# Altium project HELPME.PrjPCB
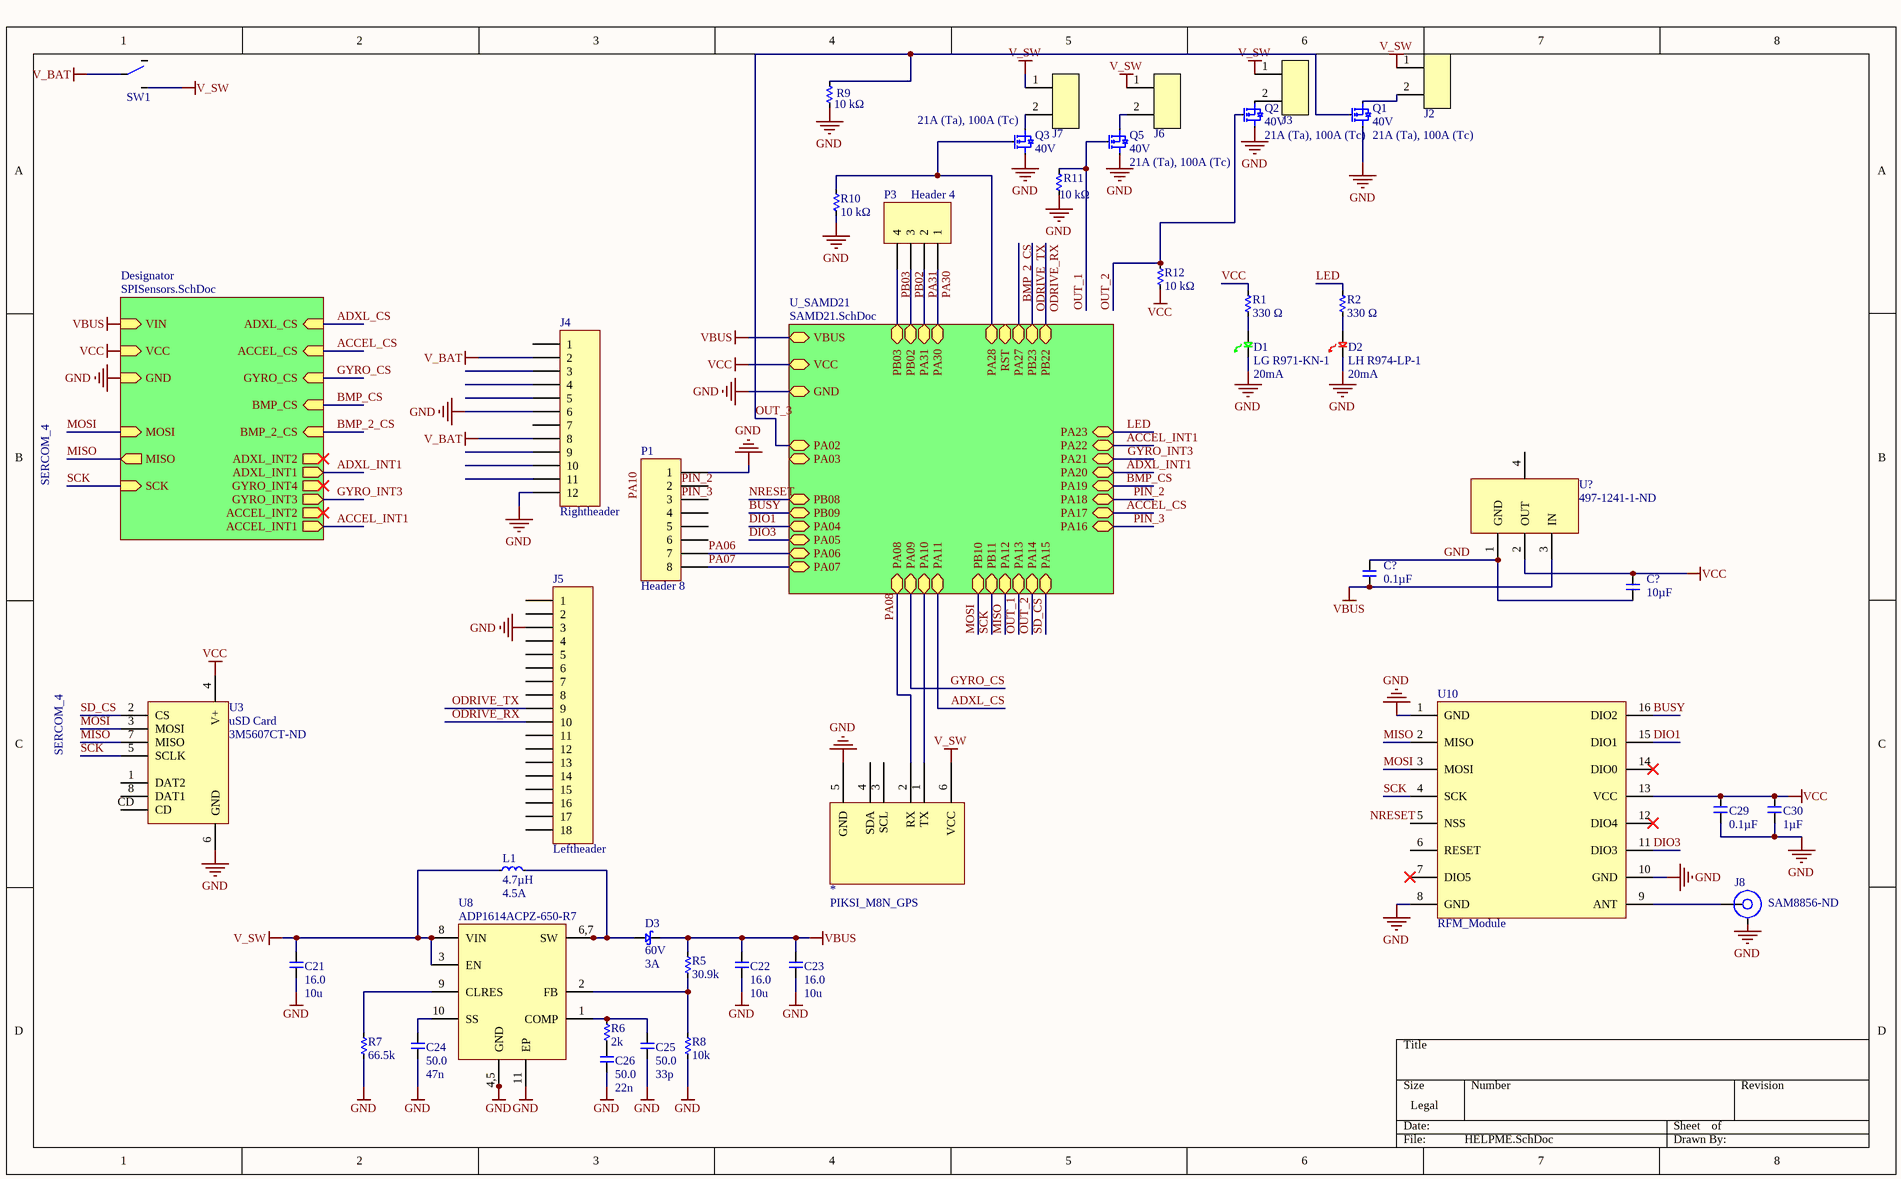
[diagram p0: HELPME.SchDoc]
3 sheets, 76 parts. Net scope: strictly hierarchical (ports join the sheet entries above them; power ports are local).
Board file: HELPME.PcbDoc
Sheets:
  HELPME.SchDoc
    U_SAMD21 = SAMD21.SchDoc
    Designator = SPISensors.SchDoc

## Sheet HELPME.SchDoc
size Legal

### Parts
(Parts that share a designator on the sheet are numbered #1, #2 ... from top to bottom, then left to right.)
*#1  PIKSI_M8N_GPS  [PIKSI_M8N_GPS]
C21  voltage: 16.0  human_value: 10u  [C0805]  (hidden comment: __template_cap)
C22  voltage: 16.0  human_value: 10u  [C0805]  (hidden comment: __template_cap)
C23  voltage: 16.0  human_value: 10u  [C0805]  (hidden comment: __template_cap)
C24  voltage: 50.0  human_value: 47n  [C0805]  (hidden comment: __template_cap)
C25  voltage: 50.0  human_value: 33p  [C0805]  (hidden comment: __template_cap)
C26  voltage: 50.0  human_value: 22n  [C0805]  (hidden comment: __template_cap)
C29  Capacitance (shorthand): 0.1µF  [C0603]  (hidden comment: __template_cap)
C30  Capacitance (shorthand): 1µF  [C0603]  (hidden comment: __template_cap)
C?#1  Capacitance (shorthand): 0.1µF  [C0603]  (hidden comment: __template_cap)
C?#2  Capacitance (shorthand): 10µF  [C0603]  (hidden comment: __template_cap)
D1  Manufacturer Part Number: LG R971-KN-1  Current - Test: 20mA  [0805_Diode]  (hidden comment: LED_LY971)
D2  Manufacturer Part Number: LH R974-LP-1  Current - Test: 20mA  [0805_Diode]  (hidden comment: LED_LY974)
D3  Voltage - DC Reverse (Vr) (Max): 60V  Current - Average Rectified (Io): 3A  [SMA]  (hidden comment: SCHOTTKY_B360A-13-F)
J2  CONN_BARRIER_STRIP_2POS  [TE_BARRIER_STRIP_2POS]  (value not drawn)
J3  CONN_BARRIER_STRIP_2POS  [TE_BARRIER_STRIP_2POS]  (value not drawn)
J4  Rightheader  [HDR1X12]
J5  Leftheader  [HDR1X18]
J6  CONN_BARRIER_STRIP_2POS  [TE_BARRIER_STRIP_2POS]  (value not drawn)
J7  CONN_BARRIER_STRIP_2POS  [TE_BARRIER_STRIP_2POS]  (value not drawn)
J8  Supplier Part Number 1: SAM8856-ND  [SMA_SAMTEC_SMA-J-P-X-RA-TH1]  (hidden comment: SMA_SAMTEC_TH_RA)
L1  Inductance: 4.7µH  Current Rating: 4.5A  [SMD5230]  (hidden comment: IND_IHLP2020CZER4R7M11)
P1  Header 8  [HDR1X8]
P3  Header 4  [HDR1X4]
Q1  Drain to Source Voltage (Vdss): 40V  Current - Continuous Drain (Id) @ 25°C: 21A (Ta), 100A (Tc)  [8PTDFN]  (hidden comment: NFET_BSC035N04LSG)
Q2  Drain to Source Voltage (Vdss): 40V  Current - Continuous Drain (Id) @ 25°C: 21A (Ta), 100A (Tc)  [8PTDFN]  (hidden comment: NFET_BSC035N04LSG)
Q3  Drain to Source Voltage (Vdss): 40V  Current - Continuous Drain (Id) @ 25°C: 21A (Ta), 100A (Tc)  [8PTDFN]  (hidden comment: NFET_BSC035N04LSG)
Q5  Drain to Source Voltage (Vdss): 40V  Current - Continuous Drain (Id) @ 25°C: 21A (Ta), 100A (Tc)  [8PTDFN]  (hidden comment: NFET_BSC035N04LSG)
R1  Resistance: 330 Ω  [R0603]  (hidden comment: __template_resistor)
R2  Resistance: 330 Ω  [R0603]  (hidden comment: __template_resistor)
R5  value 30.9k  [R0603]  (hidden comment: __template_resistor)
R6  value 2k  [R0603]  (hidden comment: __template_resistor)
R7  value 66.5k  [R0603]  (hidden comment: __template_resistor)
R8  value 10k  [R0603]  (hidden comment: __template_resistor)
R9  Resistance: 10 kΩ  [R0805]  (hidden comment: __template_resistor)
R10  Resistance: 10 kΩ  [R0805]  (hidden comment: __template_resistor)
R11  Resistance: 10 kΩ  [R0805]  (hidden comment: __template_resistor)
R12  Resistance: 10 kΩ  [R0805]  (hidden comment: __template_resistor)
SW1  SWITCH_500SSP1S1M6QEA  [SWITCH_500SSP1S1M6QEA]  (value not drawn)
U3  uSD Card  Supplier Part Number 1: 3M5607CT-ND  [MICROSD_CARD_SOCKET]
U8  Manufacturer Part Number: ADP1614ACPZ-650-R7  [10DFN3X3]  (hidden comment: BOOST_ADP1614_650_R7)
U10  RFM_Module  [RFM-22]
U?  Supplier Part Number 1: 497-1241-1-ND  [4SOT223]  (hidden comment: LDO_LD1117S33CTR)

### Sub-sheets
Designator = SPISensors.SchDoc: VIN (in), ACCEL_CS (in), ADXL_CS (in), BMP_CS (in), GYRO_CS (in), VCC (in), GND (in), MOSI (in), MISO (out), SCK (in), GYRO_INT4 (out), ADXL_INT1 (out), GYRO_INT3 (out), ADXL_INT2 (out), ACCEL_INT2 (out), ACCEL_INT1 (out), BMP_2_CS (in)
U_SAMD21 = SAMD21.SchDoc: PB10 (bidir), PA15 (bidir), PA12 (bidir), GND (bidir), RST (bidir), PA28 (bidir), PA08 (bidir), PA09 (bidir), PA10 (bidir), VCC (bidir), PA11 (bidir), PB11 (bidir), PA13 (bidir), PA14 (bidir), PA02 (bidir), PA03 (bidir), PB08 (bidir), PB09 (bidir), PA04 (bidir), PA05 (bidir), PA06 (bidir), PA07 (bidir), PA17 (bidir), PA18 (bidir), PA19 (bidir), PA20 (bidir), PA21 (bidir), PA22 (bidir), PA23 (bidir), PA30 (bidir), PB23 (bidir), PB22 (bidir), PA27 (bidir), PA31 (bidir), VBUS (bidir), PB03 (bidir), PB02 (bidir), PA16 (bidir)

### Nets
GND: *#1.5(GND) C21.2 C22.2 C23.2 C24.2 C25.2 C26.2 C29.2 C30.2 C?#1.1 C?#2.2 D1.1 D2.1 J4.6 J4.12 J5.3 P1.1 Q1.2 Q2.2 Q3.2 Q5.2 R7.1 R8.1 R9.1 R10.2 R11.2 U3.6(GND) U8.4,5(GND) U8.5(GND2) U8.11(EP) U10.1(GND) U10.8(GND) U10.10(GND) U?.1(GND) ; sheet U_SAMD21/GND, sheet Designator/GND
V_BAT: J4.2 J4.8 SW1.2
V_SW: *#1.6(VCC) C21.1 J2.1 J3.1 J6.1 J7.1 L1.1 SW1.1 U8.3(EN) U8.8(VIN)
VBUS: C22.1 C23.1 C?#1.2 D3.2 R5.2 U?.3(IN) ; sheet U_SAMD21/VBUS, sheet Designator/VIN
VCC: C29.1 C30.1 C?#2.1 R1.2 R12.1 U3.4(V+) U10.13(VCC) U?.2(OUT) ; sheet U_SAMD21/VCC, sheet Designator/VCC
ACCEL_CS: sheet U_SAMD21/PA17, sheet Designator/ACCEL_CS
ACCEL_INT1: sheet U_SAMD21/PA22, sheet Designator/ACCEL_INT1
ADXL_CS: sheet U_SAMD21/PA11, sheet Designator/ADXL_CS
ADXL_INT1: sheet U_SAMD21/PA20, sheet Designator/ADXL_INT1
BMP_2_CS: sheet U_SAMD21/PA27, sheet Designator/BMP_2_CS
BMP_CS: sheet U_SAMD21/PA19, sheet Designator/BMP_CS
BUSY: U10.16(DIO2) ; sheet U_SAMD21/PB09
DIO1: U10.15(DIO1) ; sheet U_SAMD21/PA04
DIO3: U10.11(DIO3) ; sheet U_SAMD21/PA05
GYRO_CS: sheet U_SAMD21/PA09, sheet Designator/GYRO_CS
GYRO_INT3: sheet U_SAMD21/PA21, sheet Designator/GYRO_INT3
LED: R2.2 ; sheet U_SAMD21/PA23
MISO: U3.7(MISO) U10.2(MISO) ; sheet U_SAMD21/PA12, sheet Designator/MISO
MOSI: U3.3(MOSI) U10.3(MOSI) ; sheet U_SAMD21/PB10, sheet Designator/MOSI
ODRIVE_RX: J5.10 ; sheet U_SAMD21/PB22
ODRIVE_TX: J5.9 ; sheet U_SAMD21/PB23
OUT_1: Q5.1 R11.1 ; sheet U_SAMD21/PA13
OUT_2: Q2.1 R12.2 ; sheet U_SAMD21/PA14
OUT_3: Q1.1 R9.2 ; sheet U_SAMD21/PA02
PA06: P1.7 ; sheet U_SAMD21/PA06
PA07: P1.8 ; sheet U_SAMD21/PA07
PA08: *#1.2(RX) ; sheet U_SAMD21/PA08
PA10: *#1.1(TX) ; sheet U_SAMD21/PA10
PA28: Q3.1 R10.1 ; sheet U_SAMD21/PA28
PA30: P3.1 ; sheet U_SAMD21/PA30
PA31: P3.2 ; sheet U_SAMD21/PA31
PB02: P3.3 ; sheet U_SAMD21/PB02
PB03: P3.4 ; sheet U_SAMD21/PB03
SCK: U3.5(SCLK) U10.4(SCK) ; sheet U_SAMD21/PB11, sheet Designator/SCK
SD_CS: U3.2(CS) ; sheet U_SAMD21/PA15
NetC24_1: C24.1 U8.10(SS)
NetC25_1: C25.1 R6.2 U8.1(COMP)
NetC26_1: C26.1 R6.1
NetD1_2: D1.2 R1.1
NetD2_2: D2.2 R2.1
NetD3_1: D3.1 L1.2 U8.6,7(SW) U8.7(SW2)
NetJ2_2: J2.2 Q1.3
NetJ3_2: J3.2 Q2.3
NetJ6_2: J6.2 Q5.3
NetJ7_2: J7.2 Q3.3
NetJ8_SIG: J8.SIG U10.9(ANT)
NetR5_1: R5.1 R8.2 U8.2(FB)
NetR7_2: R7.2 U8.9(CLRES)

Not connected (* = marked no-connect by the designer): *#1 3(SCL) 4(SDA); J4 1 3 4 5 7 9 10 11; J5 1 2 4 5 6 7 8 11 12 13 14 15 16 17 18; J8 GND; P1 2 3 4 5 6; SW1 3; U3 1(DAT2) 8(DAT1) CD; U10 5(NSS) 6(RESET) 7(DIO5)* 12(DIO4)* 14(DIO0)*; U? 4(GND)

### Notes on the sheet
- SERCOM_4
- Labels drawn without touching a wire or pin: GND, NRESET, PA10, PIN_2, PIN_3

### Library data of the parts
C21-C23 = 587-1295-1-ND: type: capacitor; value: 1e-05; tolerance: 10%; Supplier Part Number 1: 587-1295-1-ND; package: 0805; price: 0.315
C24 = 478-1391-1-ND: type: capacitor; value: 4.7e-08; tolerance: 10%; Supplier Part Number 1: 478-1391-1-ND; package: 0805; price: 0.2
C25 = 399-1115-1-ND: type: capacitor; value: 3.3e-11; tolerance: 5%; Supplier Part Number 1: 399-1115-1-ND; package: 0805; price: 0.11
C26 = 478-1387-1-ND: type: capacitor; value: 2.2e-08; tolerance: 10%; Supplier Part Number 1: 478-1387-1-ND; package: 0805; price: 0.14
C29 = 490-1519-1-ND: CAP CER 0603 0.1µF X7R 50V 10%; Manufacturer: Murata Electronics North America; Capacitance - pF (Machine readable): #NAME?; type: capacitor; Rated Voltage: 50V; Supplier Part Number 1: 490-1519-1-ND; Dielectric: X7R; Supplier 1: Digikey
C30 = 490-3900-1-ND: CAP CER 0603 1µF X7R 16V 10%; Manufacturer: Murata Electronics North America; Capacitance - pF (Machine readable): #NAME?; type: capacitor; Rated Voltage: 16V; Supplier Part Number 1: 490-3900-1-ND; Dielectric: X7R; Supplier 1: Digikey
C?#1 = CAP CER 0603 0.1µF X7R 50V 10%: Manufacturer: Murata Electronics North America; Capacitance - pF (Machine readable): 100000; type: capacitor; Dielectric: X7R; Supplier 1: Digikey; Supplier Part Number 1: 490-1519-1-ND
C?#2 = CAP CER 10UF 35V X5R 0603 20%: Manufacturer: Murata Electronics North America; Capacitance - pF (Machine readable): 10000000; type: capacitor; Dielectric: X5R; Supplier 1: Digikey; Supplier Part Number 1: 490-13248-1-ND
D1 = LED_LY971: LED 0805 GREEN 20MA; Manufacturer: OSRAM Opto Semiconductors Inc; Wavelength - Dominant: 570nm; Wavelength - Peak: 572nm; Millicandela Rating: 26.05mcd; Voltage - Forward (Vf) (Typ): 2.2V; Viewing Angle: 160°; Lens Transparency: Diffused; Lens Color: White; Lens Style/Size: Rectangle with Flat Top, 1.30mm x 1.25mm; Supplier 1: Digi-Key; RoHS: RoHS Compliant; Category: Optoelectronics; Stock 1: 89733; Pricing 1: 1=0.08, 10=0.069, 100=0.0548, 250=0.04796, 500=0.04384 (USD); Packaging: Cut Tape (CT); Color: Green; Package / Case: 0805 (2012 Metric); Supplier Device Package: *; Size / Dimension: 2.00mm L x 1.25mm W; Height (Max): 0.80mm; Mounting Type: Surface Mount; ComponentLink1URL: http://www.osram-os.com/Graphics/XPic9/00078860_0.pdf; ComponentLink1Description: http://www.osram-os.com/Graphics/XPic9/00078860_0.pdf; Supplier Part Number 1: 475-1410-1-ND
D2 = LED_LY974: LED 0805 RED 20MA; Manufacturer: OSRAM Opto Semiconductors Inc; Wavelength - Dominant: 645nm; Wavelength - Peak: 660nm; Millicandela Rating: 41mcd; Voltage - Forward (Vf) (Typ): 1.8V; Viewing Angle: 160°; Lens Transparency: Diffused; Lens Color: White; Lens Style/Size: Rectangle with Flat Top, 1.30mm x 1.25mm; Supplier 1: Digi-Key; RoHS: RoHS Compliant; Category: Optoelectronics; Stock 1: 66379; Pricing 1: 1=0.08, 10=0.07, 100=0.0559, 250=0.04892, 500=0.04472 (USD); Packaging: Cut Tape (CT); Color: Red; Package / Case: 0805 (2012 Metric); Supplier Device Package: *; Size / Dimension: 2.00mm L x 1.25mm W; Height (Max): 0.80mm; Mounting Type: Surface Mount; ComponentLink1URL: http://www.osram-os.com/Graphics/XPic8/00078869_0.pdf; ComponentLink1Description: http://www.osram-os.com/Graphics/XPic8/00078869_0.pdf; Supplier Part Number 1: 475-1415-1-ND
D3 = SCHOTTKY_B360A-13-F: DIODE SCHOTTKY 40V 3A SMA; Manufacturer: Diodes Incorporated; Voltage - Forward (Vf) (Max) @ If: 700mV @ 3A; Speed: Fast Recovery =< 500ns, > 200mA (Io); Current - Reverse Leakage @ Vr: 500µA @ 60V; Capacitance @ Vr, F: 200pF @ 4V, 1MHz; Supplier 1: Digi-Key; Manufacturer Part Number: B360A-13-F; RoHS: RoHS Compliant; Category: Discrete Semiconductor Products; Stock 1: 71246; Pricing 1: 1=0.45, 10=0.363 (USD); Packaging: Cut Tape (CT); Part Status: Active; Diode Type: Schottky; Reverse Recovery Time (trr): -; Mounting Type: Surface Mount; Package / Case: DO-214AC, SMA; Supplier Device Package: SMA; Operating Temperature - Junction: -55°C ~ 150°C; ComponentLink1URL: http://www.diodes.com/_files/datasheets/ds30891.pdf; ComponentLink1Description: http://www.diodes.com/_files/datasheets/ds30891.pdf; Supplier Part Number 1: B360A-FDICT-ND
J2 J3 J6 J7 = CONN_BARRIER_STRIP_2POS: CONN BARRIER STRIP 2CIRC .375; Manufacturer: TE Connectivity; Manufacturer Part Number: 3-1437664-0; Number of Circuits: 2; Pitch: 0.375" (9.53mm); Current Rating: 20A; Voltage Rating: 300V; Wire Gauge: 12-22 AWG; Top Termination: Screws with Captive Plate; Bottom Termination: PC Pin; Barrier Type: 2 Wall (Dual); Material - Insulation: Polyamide (PA), Nylon; Material Flammability Rating: UL94 V-0; Supplier 1: Digi-Key; RoHS: RoHS Compliant; Category: Connectors, Interconnects; Stock 1: 24942; Pricing 1: 1=0.52, 10=0.483, 25=0.4348, 50=0.3864, 100=0.3703, 250=0.33812, 500=0.322, 1000=0.26565, 2500=0.2415 (USD); Terminal Block Type: Barrier Block; Number of Wire Entries: 2; Number of Rows: 1; Features: -; Color: Black; Packaging: Bulk; Terminal Material: Steel; Terminal Finish: Zinc; Mounting Type: Through Hole; Operating Temperature: -40°C ~ 105°C; ComponentLink1URL: http://www.te.com/commerce/DocumentDelivery/DDEController?Action=srchrtrv&DocNm=3-1437664-0&DocType=Customer+Drawing&DocLang=English; ComponentLink1Description: Datasheet; Supplier Part Number 1: A98495-ND
J4 = Header 12: Header, 12-Pin; LatestRevisionDate: 17-Jul-2002; LatestRevisionNote: Re-released for DXP Platform.; Publisher: Altium Limited
J5 = Header 18: Header, 18-Pin; LatestRevisionDate: 17-Jul-2002; LatestRevisionNote: Re-released for DXP Platform.; Publisher: Altium Limited
L1 = IND_IHLP2020CZER4R7M11: INDUCTOR POWER 4.7UH 4.5A SMD; Manufacturer: Vishay Dale; Current - Saturation: 5.2A; Tolerance: ±20%; Shielding: Shielded; DC Resistance (DCR): 60 mOhm Max; Frequency - Test: 100kHz; Supplier 1: Digi-Key; Manufacturer Part Number: IHLP2020CZER4R7M11; RoHS: RoHS Compliant; Category: Inductors, Coils, Chokes; Stock 1: 5793; Pricing 1: 1=1.35, 10=1.251, 25=1.1552, 50=0.9626, 100=0.9048 (USD); Type: -; Material - Core: -; Q @ Freq: -; Frequency - Self Resonant: -; Operating Temperature: -55°C ~ 125°C; Package / Case: Non Standard; Size / Dimension: 0.216" L x 0.204" W x 0.118" H (5.49mm x 5.18mm x 3.00mm); Mounting Type: Surface Mount; Packaging: Cut Tape (CT); ComponentLink1URL: http://www.vishay.com/docs/34260/lp20cz11.pdf; ComponentLink1Description: Datasheet; Supplier Part Number 1: 541-1238-1-ND
P1 = Header 8: Header, 8-Pin; LatestRevisionDate: 17-Jul-2002; LatestRevisionNote: Re-released for DXP Platform.; Publisher: Altium Limited
P3 = Header 4: Header, 4-Pin; LatestRevisionDate: 17-Jul-2002; LatestRevisionNote: Re-released for DXP Platform.; Publisher: Altium Limited
Q1-Q3 Q5 = NFET_BSC035N04LSG: MOSFET N-CH 40V 100A TDSON-8; Manufacturer: Infineon Technologies; Manufacturer Part Number: BSC035N04LSGATMA1; FET Type: MOSFET N-Channel, Metal Oxide; FET Feature: Logic Level Gate; Rds On (Max) @ Id, Vgs: 3.5 mOhm @ 50A, 10V; Vgs(th) (Max) @ Id: 2V @ 36µA; Gate Charge (Qg) @ Vgs: 64nC @ 10V; Input Capacitance (Ciss) @ Vds: 5100pF @ 20V; Power - Max: 69W; Supplier 1: Digi-Key; RoHS: RoHS Compliant; Category: Discrete Semiconductor Products; Stock 1: 22194; Pricing 1: 1=0.95, 10=0.833, 100=0.637, 500=0.5047, 1000=0.40425 (USD); Packaging: Cut Tape (CT); Operating Temperature: -55°C ~ 150°C (TJ); Mounting Type: Surface Mount; Package / Case: 8-PowerTDFN; Supplier Device Package: PG-TDSON-8; ComponentLink1URL: http://www.infineon.com/dgdl/BSC035N04LSG_rev1.02.pdf?folderId=db3a3043156fd5730115c7d50620107c&fileId=db3a30431689f4420116c4388f820817; ComponentLink1Description: http://www.infineon.com/dgdl/BSC035N04LSG_rev1.02.pdf?folderId=db3a3043156fd5730115c7d50620107c&fileId=db3a30431689f4420116c4388f820817; Supplier Part Number 1: BSC035N04LSGATMA1CT-ND
R1 R2 = RES SMD 330 OHM 1% 1/10W 0603: Manufacturer Part Number: RC0603FR-07330RL; Manufacturer: Yageo; Resistance (Sortable): 330; Tolerance: ±1%; Power (Watts): 0.1W, 1/10W; Temperature Coefficient: ±100ppm/°C; Supplier 1: Digikey; Datasheets: http://www.yageo.com/documents/recent/PYu-RC_Group_51_RoHS_L_9.pdf; Image: //media.digikey.com/Renders/Yageo%20Renders/0603-(1608-Metric).jpg; Supplier Part Number 1: 311-330HRCT-ND; Operating Temperature: -55°C ~ 155°C
R5 = CRCW060330K9FKEA: RES SMD 30.9K OHM 1% 1/10W 0603; Manufacturer: Vishay Dale; Resistance (Machine readable): 30900; Unit Price (USD): 0.081; Power (Watts): 0.1W, 1/10W; Supplier Part Number: 541-30.9KHCT-ND; Manufacturer Part Number: CRCW060330K9FKEA; type: resistor; Packaging: Cut Tape (CT); Series: CRCW; Tolerance: ±1%; Package: 0603 (1608 Metric)
R6 = CRCW06032K00FKEA: RES SMD 2K OHM 1% 1/10W 0603; Manufacturer: Vishay Dale; Resistance (Machine readable): 2000; Unit Price (USD): 0.081; Power (Watts): 0.1W, 1/10W; Supplier Part Number: 541-2.00KHCT-ND; Manufacturer Part Number: CRCW06032K00FKEA; type: resistor; Packaging: Cut Tape (CT); Series: CRCW; Tolerance: ±1%; Package: 0603 (1608 Metric)
R7 = CRCW060366K5FKEA: RES SMD 66.5K OHM 1% 1/10W 0603; Manufacturer: Vishay Dale; Resistance (Machine readable): 66500; Unit Price (USD): 0.081; Power (Watts): 0.1W, 1/10W; Supplier Part Number: 541-66.5KHCT-ND; Manufacturer Part Number: CRCW060366K5FKEA; type: resistor; Packaging: Cut Tape (CT); Series: CRCW; Tolerance: ±1%; Package: 0603 (1608 Metric)
R8 = CRCW060310K0FKEA: RES SMD 10K OHM 1% 1/10W 0603; Manufacturer: Vishay Dale; Resistance (Machine readable): 10000; Unit Price (USD): 0.081; Power (Watts): 0.1W, 1/10W; Supplier Part Number: 541-10.0KHCT-ND; Manufacturer Part Number: CRCW060310K0FKEA; type: resistor; Packaging: Cut Tape (CT); Series: CRCW; Tolerance: ±1%; Package: 0603 (1608 Metric)
R9-R12 = RES SMD 10K OHM 1% 1/8W 0805: Manufacturer Part Number: RC0805FR-0710KL; Manufacturer: Yageo; Resistance (Sortable): 10000; Tolerance: ±1%; Power (Watts): 0.125W, 1/8W; Temperature Coefficient: ±100ppm/°C; Supplier 1: Digikey; Datasheets: http://www.yageo.com/documents/recent/PYu-RC_Group_51_RoHS_L_9.pdf; Image: //media.digikey.com/Renders/Yageo%20Renders/0805-(2012-Metric).jpg; Supplier Part Number 1: 311-10.0KCRCT-ND; Operating Temperature: -55°C ~ 155°C
SW1 = SWITCH_500SSP1S1M6QEA: SWITCH SLIDE SPDT R/A 5A; Manufacturer: E-Switch; Contact Timing: Not Specified; Switch Function: On-On; Current Rating: 5A (AC/DC); Voltage Rating - AC: 120V; Voltage Rating - DC: 28V; Actuator Type: Standard; Actuator Length: 4.72mm; Actuator Material: Polyamide (PA), Nylon; Switch Travel: 2.16mm; Mechanical Life: 30,000 Cycles; Supplier 1: Digi-Key; Manufacturer Part Number: 500SSP1S1M6QEA; RoHS: RoHS Compliant; Category: Switches; Stock 1: 8402; Pricing 1: 1=2.93, 10=2.808, 25=2.7484, 50=2.39, 100=2.3303, 250=2.27052, 500=1.912, 1000=1.7925, 5000=1.64313 (USD); Packaging: Bulk; Part Status: Active; Circuit: SPDT; Contact Material: Copper Alloy; Contact Finish: Silver; Mounting Type: Through Hole, Right Angle; Termination Style: PC Pin; Features: Epoxy Sealed Terminals; Operating Temperature: -30°C ~ 85°C; Electrical Life: 30,000 Cycles; Operating Force: -; ComponentLink1URL: http://spec_sheets.e-switch.com/specs/T511006.pdf; ComponentLink1Description: http://spec_sheets.e-switch.com/specs/T511006.pdf; Supplier Part Number 1: EG2478-ND
U3 = MICRO_SD_CARD_HOLDER: MICROSD CARD HOLDER, PUSH-PUSH; pin to pad: 6>6+SHIELD1+SHIELD2+SHIELD3; Manufacturer: 3M; Manufacturer Part Number: 2908-05WB-MG; Card Type: Secure Digital - microSD™; Number of Positions: 10 (8 + 2); Connector Type: Connector and Ejector; Insertion, Removal Method: Push In, Push Out; Supplier 1: Digi-Key; RoHS: RoHS Compliant; Category: Connectors, Interconnects; Stock 1: 32313; Pricing 1: 1=3.6, 10=3.458, 25=3.1704, 50=3.0262, 100=2.882, 250=2.52176, 500=2.4497, 1000=2.08945 (USD); Packaging: Cut Tape (CT); Ejector Side: -; Mounting Type: Surface Mount, Right Angle; Features: Switch; Height Above Board: 0.073" (1.85mm); Mounting Feature: Normal, Standard - Top; Contact Finish: Gold; Contact Finish Thickness: 15µin (0.38µm); ComponentLink1URL: http://multimedia.3m.com/mws/media/416257O/3mtm-card-connector-microsdtm-2900-series-ts2197.pdf; ComponentLink1Description: http://multimedia.3m.com/mws/media/416257O/3mtm-card-connector-microsdtm-2900-series-ts2197.pdf
U8 = BOOST_ADP1614_650_R7: IC BOOST ADJ 4A 10DFN 650kHZ; Manufacturer: Analog Devices Inc.; Function: Step-Up; Output Configuration: Positive; Output Type: Adjustable; Number of Outputs: 1; Voltage - Input (Min): 2.5V; Voltage - Input (Max): 5.5V; Voltage - Output (Max): 20V; Current - Output: 4A (Switch); Synchronous Rectifier: No; Supplier 1: Digi-Key; RoHS: RoHS Compliant; Category: Integrated Circuits (ICs); Stock 1: 513; Pricing 1: 1=2.81, 10=2.528, 100=2.0321, 500=1.66956 (USD); Packaging: Cut Tape (CT); Part Status: Active; Topology: Boost; Voltage - Output (Min/Fixed): 2.5V; Frequency - Switching: 650kHz; Operating Temperature: -40°C ~ 125°C (TJ); Mounting Type: Surface Mount; Package / Case: 10-WFDFN Exposed Pad, CSP; Supplier Device Package: 10-LFCSP-WD (3x3); ComponentLink1URL: http://www.analog.com/media/en/technical-documentation/data-sheets/ADP1614.pdf; ComponentLink1Description: http://www.analog.com/media/en/technical-documentation/data-sheets/ADP1614.pdf; Supplier Part Number 1: ADP1614ACPZ-650-R7CT-ND
U? = LDO_LD1117S33CTR: IC VOLTAGE REG 3.3V 800MA SOT223 INDUSTRIAL TEMP; Manufacturer: STMicroelectronics; Regulator Topology: Positive Fixed; Voltage - Dropout (Typical): 1.1V @ 800mA; Number of Regulators: 1; Voltage - Input: Up to 15V; Supplier 1: Digi-Key; Manufacturer Part Number: LD1117S33CTR; RoHS: RoHS Compliant; Category: Integrated Circuits (ICs); Stock 1: 63873; Pricing 1: 1=0.46, 10=0.373, 100=0.2538, 500=0.19034, 1000=0.14276 (USD); Packaging: Cut Tape (CT); Part Status: Active; Voltage - Output: 3.3V; Current - Output: 800mA; Current - Limit (Min): -; Operating Temperature: -40°C ~ 125°C; Mounting Type: Surface Mount; Package / Case: TO-261-4, TO-261AA; Supplier Device Package: SOT-223; ComponentLink1URL: http://www.st.com/content/ccc/resource/technical/document/datasheet/99/3b/7d/91/91/51/4b/be/CD00000544.pdf/files/CD00000544.pdf/jcr:content/translations/en.CD00000544.pdf; ComponentLink1Description: http://www.st.com/content/ccc/resource/technical/document/datasheet/99/3b/7d/91/91/51/4b/be/CD00000544.pdf/files/CD00000544.pdf/jcr:content/translations/en.CD00000544.pdf
J8 = SMA_SAMTEC_TH_RA: Supplier 1: Digi-Key

## Sheet SAMD21.SchDoc
size A
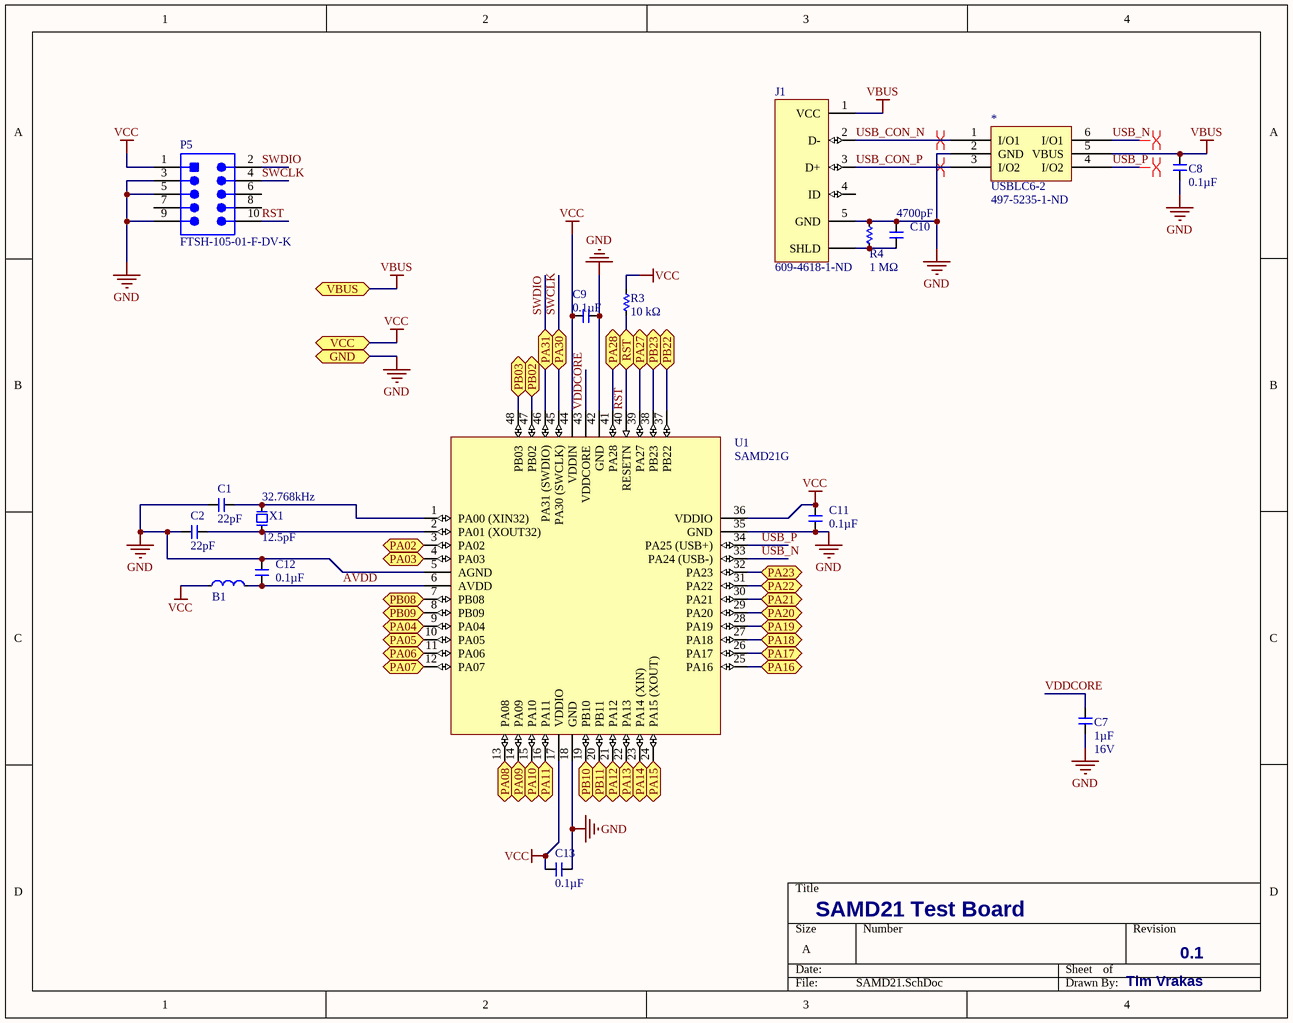
[diagram p1: SAMD21.SchDoc]

### Parts
(Parts that share a designator on the sheet are numbered #1, #2 ... from top to bottom, then left to right.)
*#2  USBLC6-2  Supplier Part Number 1: 497-5235-1-ND  [6SOT23]
B1  FB_1608  [R0603]  (value not drawn)
C1  Capacitance (shorthand): 22pF  [C0603]  (hidden comment: __template_cap)
C2  Capacitance (shorthand): 22pF  [C0603]  (hidden comment: __template_cap)
C7  Capacitance (shorthand): 1µF  Rated Voltage: 16V  [C0603]  (hidden comment: __template_cap)
C8  Capacitance (shorthand): 0.1µF  [C0603]  (hidden comment: __template_cap)
C9  Capacitance (shorthand): 0.1µF  [C0603]  (hidden comment: __template_cap)
C10  Capacitance (shorthand): 4700pF  [C0603]  (hidden comment: __template_cap)
C11  Capacitance (shorthand): 0.1µF  [C0603]  (hidden comment: __template_cap)
C12  Capacitance (shorthand): 0.1µF  [C0603]  (hidden comment: __template_cap)
C13  Capacitance (shorthand): 0.1µF  [C0603]  (hidden comment: __template_cap)
J1  Supplier Part Number 1: 609-4618-1-ND  [CONN_USBMICROB_10118194-0001LF]  (hidden comment: CONN_USB_MICROB_SMD_TH_R/A)
P5  FTSH-105-01-F-DV-K  [SMTC-FTSH-105-01-L-DV-K_V]
R3  Resistance: 10 kΩ  [R0603]  (hidden comment: __template_resistor)
R4  Resistance: 1 MΩ  [R0603]  (hidden comment: __template_resistor)
U1  SAMD21G  [SAMD21 TQFP-48]
X1  Frequency: 32.768kHz  Load Capacitance: 12.5pF  [XTAL_TXC_9HT10]  (hidden comment: XTAL_9HT10-32.768KEZF-T)

### Ports
GND (bidir), PA02 (bidir), PA03 (bidir), PA04 (bidir), PA05 (bidir), PA06 (bidir), PA07 (bidir), PA08 (bidir), PA09 (bidir), PA10 (bidir), PA11 (bidir), PA12 (bidir), PA13 (bidir), PA14 (bidir), PA15 (bidir), PA16 (bidir), PA17 (bidir), PA18 (bidir), PA19 (bidir), PA20 (bidir), PA21 (bidir), PA22 (bidir), PA23 (bidir), PA27 (bidir), PA28 (bidir), PA30 (bidir), PA31 (bidir), PB02 (bidir), PB03 (bidir), PB08 (bidir), PB09 (bidir), PB10 (bidir), PB11 (bidir), PB22 (bidir), PB23 (bidir), RST (bidir), VBUS (bidir), VCC (bidir)

### Nets
GND: *#2.2(GND) C1.1 C2.1 C7.2 C8.2 C9.1 C10.1 C11.1 C12.1 C13.2 J1.5(GND) P5.3 P5.5 P5.9 R4.2 U1.5(AGND) U1.18(GND) U1.35(GND) U1.42(GND) ; port GND
VBUS: *#2.5(VBUS) C8.1 J1.1(VCC) ; port VBUS
VCC: B1.1 C9.2 C11.2 C13.1 P5.1 R3.2 U1.17(VDDIO) U1.36(VDDIO) U1.44(VDDIN) ; port VCC
ACCEL_CS: U1.26(PA17) ; port PA17
ACCEL_INT1: U1.31(PA22) ; port PA22
ADXL_CS: U1.16(PA11) ; port PA11
ADXL_INT1: U1.29(PA20) ; port PA20
AVDD: B1.2 C12.2 U1.6(AVDD)
BMP_2_CS: U1.39(PA27) ; port PA27
BMP_CS: U1.28(PA19) ; port PA19
BUSY: U1.8(PB09) ; port PB09
DIO1: U1.9(PA04) ; port PA04
DIO3: U1.10(PA05) ; port PA05
GYRO_CS: U1.14(PA09) ; port PA09
GYRO_INT3: U1.30(PA21) ; port PA21
LED: U1.32(PA23) ; port PA23
MISO: U1.21(PA12) ; port PA12
MOSI: U1.19(PB10) ; port PB10
NRESET: U1.7(PB08) ; port PB08
ODRIVE_RX: U1.37(PB22) ; port PB22
ODRIVE_TX: U1.38(PB23) ; port PB23
OUT_1: U1.22(PA13) ; port PA13
OUT_2: U1.23(PA14_(XIN)) ; port PA14
OUT_3: U1.3(PA02) ; port PA02
PA03: U1.4(PA03) ; port PA03
PA06: U1.11(PA06) ; port PA06
PA07: U1.12(PA07) ; port PA07
PA08: U1.13(PA08) ; port PA08
PA10: U1.15(PA10) ; port PA10
PA28: U1.41(PA28) ; port PA28
PB02: U1.47(PB02) ; port PB02
PB03: U1.48(PB03) ; port PB03
PIN_2: U1.27(PA18) ; port PA18
PIN_3: U1.25(PA16) ; port PA16
RST: P5.10 R3.1 U1.40(RESETN) ; port RST
SCK: U1.20(PB11) ; port PB11
SD_CS: U1.24(PA15_(XOUT)) ; port PA15
SWCLK: P5.4 U1.45(PA30_(SWCLK)) ; port PA30  [project net PA30]
SWDIO: P5.2 U1.46(PA31_(SWDIO)) ; port PA31  [project net PA31]
USB_CON_N: *#2.1(I/O1) J1.2(D-)
USB_CON_P: *#2.3(I/O2) J1.3(D+)
USB_N: *#2.6(I/O1) U1.33(PA24_(USB-))
USB_P: *#2.4(I/O2) U1.34(PA25_(USB+))
VDDCORE: C7.1 U1.43(VDDCORE)
NetC1_2: C1.2 U1.1(PA00_(XIN32)) X1.2
NetC2_2: C2.2 U1.2(PA01_(XOUT32)) X1.1
NetC10_2: C10.2 J1.SHIELD(SHLD) R4.1

Not connected (* = marked no-connect by the designer): J1 4(ID); P5 6 7 8

### Layout directives
differential pair: USB_CON_N, USB_CON_P, USB_N, USB_P

### Notes on the sheet
- SAMD21 Test Board
- 0.1
- Tim Vrakas

### Library data of the parts
*#2 = USBLC6-2: Manufacturer: STMicroelectronics; Manufacturer Part Number: USBLC6-2SC6; Unidirectional Channels: 2; Voltage - Reverse Standoff (Typ): 5.25V; Voltage - Breakdown (Min): 6V; Voltage - Clamping (Max) @ Ipp: 17V; Current - Peak Pulse (10/1000µs): 5A (8/20µs); Power Line Protection: Yes; Supplier 1: Digi-Key; RoHS: RoHS Compliant; Category: Circuit Protection; Stock 1: 31719; Pricing 1: 1=0.51, 10=0.411, 100=0.2802, 500=0.21012, 1000=0.15759 (USD); Packaging: Cut Tape (CT); Part Status: Active; Type: Steering (Rail to Rail); Bidirectional Channels: -; Power - Peak Pulse: -; Applications: Ethernet; Capacitance @ Frequency: -; Operating Temperature: -40°C ~ 125°C (TJ); Mounting Type: Surface Mount; Package / Case: SOT-23-6; Supplier Device Package: SOT-23-6; ComponentLink1URL: http://www.st.com/web/en/resource/technical/document/datasheet/CD00050750.pdf; ComponentLink1Description: http://www.st.com/web/en/resource/technical/document/datasheet/CD00050750.pdf
B1 = FB_1608: FERRITE BEAD 600 OHM 300mA; Manufacturer: Taiyo Yuden; Manufacturer Part Number: BK1608HW601-T; Number of Lines: 1; Impedance @ Frequency: 600 Ohm @ 100MHz; DC Resistance (DCR) (Max): 400 mOhm; Supplier 1: Digi-Key; Supplier Part Number 1: 587-1879-1-ND; RoHS: RoHS Compliant; Category: Filters; Stock 1: 11908; Pricing 1: 1=0.1, 10=0.059, 50=0.0474, 100=0.0426, 250=0.0312, 500=0.0227, 1000=0.02223 (USD); Packaging: Cut Tape (CT); Part Status: Active; Filter Type: -; Current Rating (Max): 300mA; Ratings: -; Operating Temperature: -55°C ~ 125°C; Package / Case: 0603 (1608 Metric); Mounting Type: Surface Mount; Height (Max): 0.037" (0.95mm); Size / Dimension: 0.063" L x 0.031" W (1.60mm x 0.80mm); ComponentLink1URL: http://ds.yuden.co.jp/TYCOMPAS/ut/detail.do?productNo=BK1608HW601-T&fileName=BK1608HW601-T_SS&mode=specSheetDownload; ComponentLink1Description: http://ds.yuden.co.jp/TYCOMPAS/ut/detail.do?productNo=BK1608HW601-T&fileName=BK1608HW601-T_SS&mode=specSheetDownload
C1 C2 = CAP CER 22PF 50V C0G/NP0 0603
C7 = CAP CER 0603 1µF X7R 16V 10%: Manufacturer: Murata Electronics North America; Capacitance - pF (Machine readable): 1000000; type: capacitor; Dielectric: X7R; Supplier 1: Digikey; Supplier Part Number 1: 490-3900-1-ND
C8 C9 C11-C13 = CAP CER 0603 0.1µF X7R 50V 10%: as C?#1 on sheet HELPME; Supplier 1: Digikey; Supplier Part Number 1: 490-1519-1-ND
C10 = CAP CER 0603 4700pF X7R 50V 10%: Manufacturer: Murata Electronics North America; Capacitance - pF (Machine readable): 4700; type: capacitor; Dielectric: X7R; Supplier 1: Digikey; Supplier Part Number 1: 490-1506-1-ND
J1 = CONN_USB_MICROB_SMD_TH_R/A: Through Hole Micro USB Connector; Manufacturer: Amphenol FCI; Manufacturer Part Number: 10118194-0001LF; Gender: Receptacle; Current Rating: 1.8A; Connector Type: USB,Receptacle; Number of Contacts: 5; Insulation Resistance: 1GR; Number of Ports: 1; Max Voltage Rating (AC): 100V; Pitch: 0.65mm; Supplier 1: Digi-Key; Stock 1: 180464; Pricing 1: 1=0.46, 10=0.437, 25=0.3744, 50=0.318, 100=0.3056, 250=0.2744, 500=0.262 (USD); Mount: Surface Mount,Horizontal; Contact Material: Copper Alloy; Contact Plating: Nickel,Gold; Number of Terminals: 5; Housing Material: Polymer; Colour: Black; Min Operating Temperature: -55°C; Max Operating Temperature: 85°C; Package Quantity: 9600; Packaging: Tape and Reel; Termination: Solder; Orientation: Right Angle; Length: 8.05mm; Depth: 5mm; Radiation Hardening: No; Lead Free: Lead Free; Flammability Rating: UL94 V-0; ComponentLink1URL: https://datasheet.ciiva.com/851/10118194-851110.pdf; ComponentLink1Description: https://datasheet.ciiva.com/851/10118194-851110.pdf; ComponentLink2URL: https://datasheet.ciiva.com/851/10118194-851111.pdf; ComponentLink2Description: https://datasheet.ciiva.com/851/10118194-851111.pdf; ComponentLink3URL: https://datasheet.ciiva.com/4598/10118194ac-197217-4598807.pdf; ComponentLink3Description: https://datasheet.ciiva.com/4598/10118194ac-197217-4598807.pdf; ComponentLink4URL: https://datasheet.ciiva.com/29907/10118194-29907230.pdf; ComponentLink4Description: https://datasheet.ciiva.com/29907/10118194-29907230.pdf; ComponentLink5URL: https://datasheet.ciiva.com/26945/getdatasheetpartid-418619-26945695.pdf; ComponentLink5Description: https://datasheet.ciiva.com/26945/getdatasheetpartid-418619-26945695.pdf
P5 = CMP-2000-05352-1: Male Header, Pitch 1.27 mm, 2 x 5 Position, Height 6.12 mm, RoHS, Tube; Manufacturer: Samtec; Number of Positions: 10; Connector Type: Header,Shrouded; Number of Positions Loaded: All; Fastening Type: -; Package Reference: FTSH-105-01-L-DV-K; Termination: Solder; Package URL: http://suddendocs.samtec.com/prints/ftsh-1xx-xx-xxx-dv-xxx-footprint.pdf; Number of Rows: 2; Contact Finish Thickness: 3µin(0.08µm); Contact Type: MalePin; Manufacturer URL: http://www.samtec.com/; Series: FTSH; Features: -; Contact Finish: Gold; Color: Black; Family: RectangularConnectors-Headers,MalePins; Datasheet URL: http://suddendocs.samtec.com/prints/ftsh-1xx-xx-xxx-dv-xxx-mkt.pdf; Package Description: Male Header, Pitch 1.27 mm, 2 x 5 Position, Height 5.97 mm, Tail Length 4.32 mm; Mounting Type: SurfaceMount; Datasheet Version: Rev. ET, 10/1995; Category: Connectors,Interconnects; Packaging: Tube
R3 = RES SMD 10K OHM 1% 1/10W 0603: Manufacturer Part Number: RC0603FR-0710KL; Manufacturer: Yageo; Resistance (Sortable): 10000; Tolerance: ±1%; Power (Watts): 0.1W, 1/10W; Temperature Coefficient: ±100ppm/°C; Supplier 1: Digikey; Datasheets: http://www.yageo.com/documents/recent/PYu-RC_Group_51_RoHS_L_9.pdf; Image: //media.digikey.com/Renders/Yageo%20Renders/0603-(1608-Metric).jpg; Supplier Part Number 1: 311-10.0KHRCT-ND; Operating Temperature: -55°C ~ 155°C
R4 = RES SMD 1M OHM 1% 1/10W 0603: Manufacturer Part Number: RC0603FR-071ML; Manufacturer: Yageo; Resistance (Sortable): 1000000; Tolerance: ±1%; Power (Watts): 0.1W, 1/10W; Temperature Coefficient: ±100ppm/°C; Supplier 1: Digikey; Datasheets: http://www.yageo.com/documents/recent/PYu-RC_Group_51_RoHS_L_9.pdf; Image: //media.digikey.com/Renders/Yageo%20Renders/0603-(1608-Metric).jpg; Supplier Part Number 1: 311-1.00MHRCT-ND; Operating Temperature: -55°C ~ 155°C
U1 = SAMD21G: 48Mhz Atmel SAM ARM Cortex M0+; Supplier 2: Newark; Supplier 3: Future Electronics; Supplier 4: Digi-Key; Supplier 5: Future Electronics; Supplier 6: Newark; Supplier 7: Arrow; Supplier 8: Mouser; Supplier 9: Avnet; ComponentLink1Description: Product Page; ComponentLink1URL: https://www.microchip.com/wwwproducts/en/ATSAMD21G18; ComponentLink2Description: Datasheet; ComponentLink2URL: http://ww1.microchip.com/downloads/en/DeviceDoc/SAM-D21-Family-Datasheet-DS40001882C.pdf; Supplier 1: Farnell; Supplier Part Number 1: 2409248; Supplier Part Number 2: 15AC6160; Supplier Part Number 3: 7044615; Supplier Part Number 4: ATSAMD21G18A-AU-ND; Supplier Part Number 6: 45X9928; Supplier Part Number 7: ATSAMD21G18A-AU; Supplier Part Number 8: 556-ATSAMD21G18A-AU; Supplier Part Number 9: ATSAMD21G18A-AU; Supplier Part Number 5: ATSAMD21G18A-AU
X1 = XTAL_9HT10-32.768KEZF-T: CRYSTAL 32.768 KHZ 12.5 PF SMD; Manufacturer: TXC CORPORATION; Frequency Tolerance: ±10ppm; ESR (Equivalent Series Resistance): 70 kOhm; Operating Mode: Fundamental; Supplier 1: Digi-Key; Manufacturer Part Number: 9HT10-32.768KEZF-T; RoHS: RoHS Compliant; Category: Crystals and Oscillators; Stock 1: 5250; Pricing 1: 1=1.88, 10=1.625, 50=1.425, 100=1.125, 500=0.95, 1000=0.75 (USD); Type: kHz Crystal (Tuning Fork); Frequency Stability: -; Operating Temperature: -40°C ~ 85°C; Ratings: -; Mounting Type: Surface Mount; Package / Case: 2-SMD; Size / Dimension: 0.126" L x 0.059" W (3.20mm x 1.50mm); Height: 0.033" (0.85mm); Packaging: Cut Tape (CT); ComponentLink1URL: http://www.txccrystal.com/images/pdf/9ht10.pdf; ComponentLink1Description: Datasheet; Supplier Part Number 1: 887-1507-1-ND

## Sheet SPISensors.SchDoc
size Letter
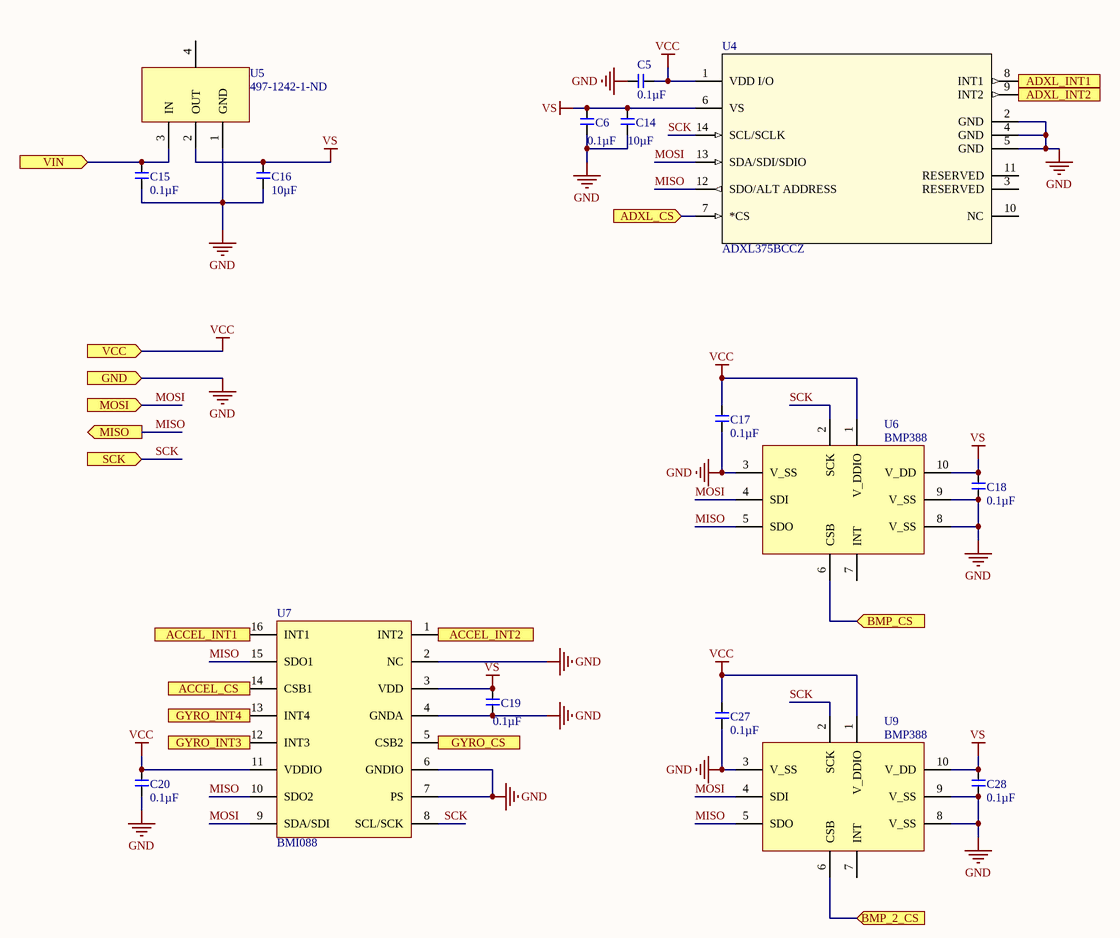
[diagram p2: SPISensors.SchDoc]

### Parts
C5  Capacitance (shorthand): 0.1µF  [C0603]  (hidden comment: __template_cap)
C6  Capacitance (shorthand): 0.1µF  [C0603]  (hidden comment: __template_cap)
C14  Capacitance (shorthand): 10µF  [C0603]  (hidden comment: __template_cap)
C15  Capacitance (shorthand): 0.1µF  [C0603]  (hidden comment: __template_cap)
C16  Capacitance (shorthand): 10µF  [C0603]  (hidden comment: __template_cap)
C17  Capacitance (shorthand): 0.1µF  [C0603]  (hidden comment: __template_cap)
C18  Capacitance (shorthand): 0.1µF  [C0603]  (hidden comment: __template_cap)
C19  Capacitance (shorthand): 0.1µF  [C0603]  (hidden comment: __template_cap)
C20  Capacitance (shorthand): 0.1µF  [C0603]  (hidden comment: __template_cap)
C27  Capacitance (shorthand): 0.1µF  [C0603]  (hidden comment: __template_cap)
C28  Capacitance (shorthand): 0.1µF  [C0603]  (hidden comment: __template_cap)
U4  ADXL375BCCZ  [LGA_CC-14-1]
U5  Supplier Part Number 1: 497-1242-1-ND  [4SOT223]  (hidden comment: REG102GA-3.3)
U6  BMP388  [8 pin LGA]
U7  BMI088  [BMI088]
U9  BMP388  [8 pin LGA]

### Ports
ACCEL_CS (in), ACCEL_INT1 (out), ACCEL_INT2 (out), ADXL_CS (in), ADXL_INT1 (out), ADXL_INT2 (out), BMP_2_CS (in), BMP_CS (in), GND (in), GYRO_CS (in), GYRO_INT3 (out), GYRO_INT4 (out), MISO (out), MOSI (in), SCK (in), VCC (in), VIN (in)

### Nets
GND: C5.2 C6.1 C14.2 C15.2 C16.2 C17.2 C18.2 C19.2 C20.2 C27.2 C28.2 U4.2(GND) U4.4(GND) U4.5(GND) U5.1(GND) U6.3(V_SS) U6.8(V_SS) U6.9(V_SS) U7.2(NC) U7.4(GNDA) U7.6(GNDIO) U7.7(PS) U9.3(V_SS) U9.8(V_SS) U9.9(V_SS) ; port GND
VBUS: C15.1 U5.3(IN) ; port VIN
VCC: C5.1 C17.1 C20.1 C27.1 U4.1(VDD_I/O) U6.1(V_DDIO) U7.11(VDDIO) U9.1(V_DDIO) ; port VCC
VS: C6.2 C14.1 C16.1 C18.1 C19.1 C28.1 U4.6(VS) U5.2(OUT) U6.10(V_DD) U7.3(VDD) U9.10(V_DD)
ACCEL_CS: U7.14(CSB1) ; port ACCEL_CS
ACCEL_INT1: U7.16(INT1) ; port ACCEL_INT1
ACCEL_INT2: U7.1(INT2) ; port ACCEL_INT2
ADXL_CS: U4.7(*CS) ; port ADXL_CS
ADXL_INT1: U4.8(INT1) ; port ADXL_INT1
ADXL_INT2: U4.9(INT2) ; port ADXL_INT2
BMP_2_CS: U9.6(CSB) ; port BMP_2_CS
BMP_CS: U6.6(CSB) ; port BMP_CS
GYRO_CS: U7.5(CSB2) ; port GYRO_CS
GYRO_INT3: U7.12(INT3) ; port GYRO_INT3
GYRO_INT4: U7.13(INT4) ; port GYRO_INT4
MISO: U4.12(SDO/ALT_ADDRESS) U6.5(SDO) U7.10(SDO2) U7.15(SDO1) U9.5(SDO) ; port MISO
MOSI: U4.13(SDA/SDI/SDIO) U6.4(SDI) U7.9(SDA/SDI) U9.4(SDI) ; port MOSI
SCK: U4.14(SCL/SCLK) U6.2(SCK) U7.8(SCL/SCK) U9.2(SCK) ; port SCK

Not connected (* = marked no-connect by the designer): U4 3(RESERVED) 10(NC) 11(RESERVED); U5 4(GND); U6 7(INT); U9 7(INT)

### Library data of the parts
C5 C6 C15 C17-C20 C27 C28 = CAP CER 0603 0.1µF X7R 50V 10%: as C?#1 on sheet HELPME; Supplier 1: Digikey; Supplier Part Number 1: 490-1519-1-ND
C14 C16 = CAP CER 10UF 35V X5R 0603 20%: as C?#2 on sheet HELPME; Supplier 1: Digikey; Supplier Part Number 1: 490-13248-1-ND
U4 = ADXL375BCCZ: 200G Accelcerometer; Value: Value; Type: Type; RefDes: RefDes; ComponentLink1Description: Datasheet; ComponentLink1URL: http://www.analog.com/media/en/technical-documentation/data-sheets/ADXL375.PDF
U5 = LDO_LD1117S33TR: IC VOLTAGE REG 3.3V 800MA SOT223; Manufacturer: STMicroelectronics; Regulator Topology: Positive Fixed; Voltage - Dropout (Typical): 1.1V @ 800mA; Number of Regulators: 1; Voltage - Input: Up to 15V; ComponentLink1URL: http://www.st.com/web/en/resource/technical/document/datasheet/CD00000544.pdf; ComponentLink1Description: http://www.st.com/web/en/resource/technical/document/datasheet/CD00000544.pdf; Supplier 1: Digi-Key; Manufacturer Part Number: LD1117S33TR; RoHS: RoHS Compliant; Category: Integrated Circuits (ICs); Stock 1: 34439; Pricing 1: 1=0.46, 10=0.373, 100=0.2541, 500=0.1902, 1000=0.14245 (USD); Packaging: Cut Tape (CT); Voltage - Output: 3.3V; Current - Output: 800mA; Current - Limit (Min): -; Operating Temperature: 0°C ~ 125°C; Mounting Type: Surface Mount; Package / Case: TO-261-4, TO-261AA; Supplier Device Package: SOT-223
U6 U9 = BMP388: Pressure Sensor 4.35 PSI ~ 18.13 PSI (30 kPa ~ 125 kPa) Absolute 10-WFLGA; Manufacturer: Bosch Sensortec; Supplier 1: Digi-Key; Manufacturer Part Number: BMP388; Stock 1: 46050; Pricing 1: 1=3.93, 5=3.466, 10=3.061, 25=2.4832, 50=2.1946, 100=2.1368, 500=1.7903, 1000=1.6748, 5000=1.5593 (USD); ComponentLink1URL: https://ae-bst.resource.bosch.com/media/_tech/media/product_flyer/BST-BMP388-FL000-00.pdf; ComponentLink1Description: https://ae-bst.resource.bosch.com/media/_tech/media/product_flyer/BST-BMP388-FL000-00.pdf
U7 = IMU_BMI088: Bosch BMI088; Supplier 1: Digi-Key; Supplier Part Number 1: 828-1082-1-ND; ComponentLink1Description: Datasheet; ComponentLink1URL: https://ae-bst.resource.bosch.com/media/_tech/media/datasheets/BST-BMI088-DS001-13.pdf

## Nets that join several sheets
GND: HELPME (34 pins), SAMD21 (19 pins), SPISensors (25 pins)
VBUS: HELPME (6 pins), SAMD21 (*#2.5 C8.1 J1.1), SPISensors (C15.1 U5.3)
VCC: HELPME (8 pins), SAMD21 (9 pins), SPISensors (8 pins)
ACCEL_CS: SAMD21 (U1.26), SPISensors (U7.14)
ACCEL_INT1: SAMD21 (U1.31), SPISensors (U7.16)
ADXL_CS: SAMD21 (U1.16), SPISensors (U4.7)
ADXL_INT1: SAMD21 (U1.29), SPISensors (U4.8)
BMP_2_CS: SAMD21 (U1.39), SPISensors (U9.6)
BMP_CS: SAMD21 (U1.28), SPISensors (U6.6)
BUSY: HELPME (U10.16), SAMD21 (U1.8)
DIO1: HELPME (U10.15), SAMD21 (U1.9)
DIO3: HELPME (U10.11), SAMD21 (U1.10)
GYRO_CS: SAMD21 (U1.14), SPISensors (U7.5)
GYRO_INT3: SAMD21 (U1.30), SPISensors (U7.12)
LED: HELPME (R2.2), SAMD21 (U1.32)
MISO: HELPME (U3.7 U10.2), SAMD21 (U1.21), SPISensors (5 pins)
MOSI: HELPME (U3.3 U10.3), SAMD21 (U1.19), SPISensors (U4.13 U6.4 U7.9 U9.4)
ODRIVE_RX: HELPME (J5.10), SAMD21 (U1.37)
ODRIVE_TX: HELPME (J5.9), SAMD21 (U1.38)
OUT_1: HELPME (Q5.1 R11.1), SAMD21 (U1.22)
OUT_2: HELPME (Q2.1 R12.2), SAMD21 (U1.23)
OUT_3: HELPME (Q1.1 R9.2), SAMD21 (U1.3)
PA06: HELPME (P1.7), SAMD21 (U1.11)
PA07: HELPME (P1.8), SAMD21 (U1.12)
PA08: HELPME (*#1.2), SAMD21 (U1.13)
PA10: HELPME (*#1.1), SAMD21 (U1.15)
PA28: HELPME (Q3.1 R10.1), SAMD21 (U1.41)
PA30: HELPME (P3.1), SAMD21 (P5.4 U1.45)
PA31: HELPME (P3.2), SAMD21 (P5.2 U1.46)
PB02: HELPME (P3.3), SAMD21 (U1.47)
PB03: HELPME (P3.4), SAMD21 (U1.48)
SCK: HELPME (U3.5 U10.4), SAMD21 (U1.20), SPISensors (U4.14 U6.2 U7.8 U9.2)
SD_CS: HELPME (U3.2), SAMD21 (U1.24)